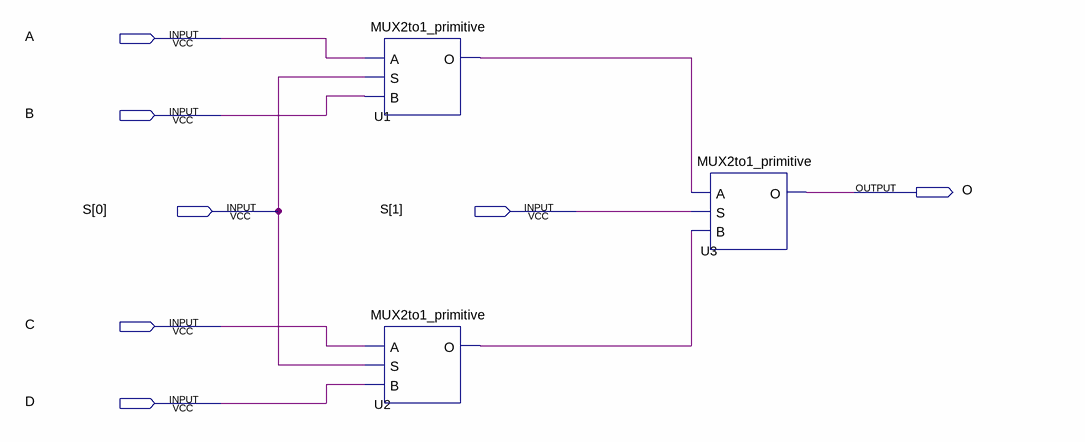
[diagram p0: schematic sheet]
// Quartus schematic MUX4to1_2to1MUX.bdf as structural Verilog: 3 symbols, 7 pins
module MUX4to1_2to1MUX (
  input  A,
  input  B,
  input  [1:0] S,
  input  C,
  input  D,
  output O
);

  wire U1_o, U2_o;

  MUX2to1_primitive U1 (.A(A), .S(S[0]), .B(B), .O(U1_o));
  MUX2to1_primitive U2 (.A(C), .S(S[0]), .B(D), .O(U2_o));
  MUX2to1_primitive U3 (.A(U1_o), .S(S[1]), .B(U2_o), .O(O));
endmodule
